# Altium schematic sheet AttinyNodeNRF24.SchDoc
size A4
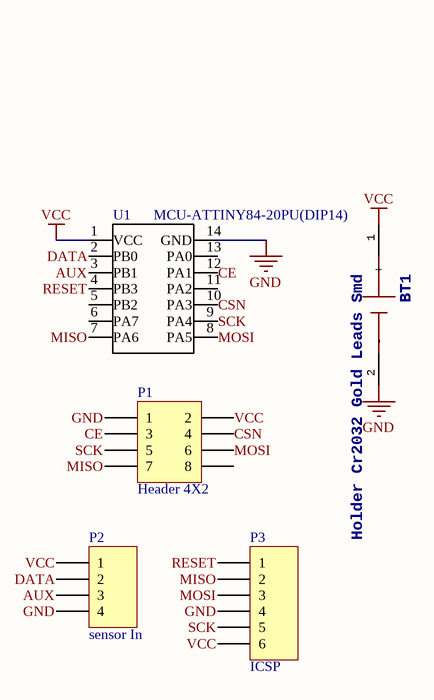
[diagram p0: AttinyNodeNRF24.SchDoc]

## Parts
BT1  Holder Cr2032 Gold Leads Smd  [CR2032 Holder _ "White"]
P1  Header 4X2  [HDR2X4]
P2  sensor In  [HDR1X4]
P3  ICSP  [HDR1X6]
U1  MCU-ATTINY84-20PU(DIP14)  [*DIP14-2.54-17.24X6.35MM]

## Nets
GND: BT1.2(-) P1.1 P2.4 P3.4 U1.14(GND)
VCC: BT1.1(+) P1.2 P2.1 P3.6 U1.1(VCC)
AUX: P2.3 U1.3(PB1)
CE: P1.3 U1.12(PA1)
CSN: P1.4 U1.10(PA3)
DATA: P2.2 U1.2(PB0)
MISO: P1.7 P3.2 U1.7(PA6)
MOSI: P1.6 P3.3 U1.8(PA5)
RESET: P3.1 U1.4(PB3)
SCK: P1.5 P3.5 U1.9(PA4)

Not connected (* = marked no-connect by the designer): P1 8; U1 5(PB2) 6(PA7) 11(PA2) 13(PA0)

## Library data of the parts
BT1 = BU2032SM-BT-GTR: MF: MPD; Price: 0.64 USD; Package: None; Availability: Good; MP: BU2032SM-BT-GTR
P1 = Header 4X2: Header, 4-Pin, Dual row; LatestRevisionDate: 17-Jul-2002; LatestRevisionNote: Re-released for DXP Platform.; Publisher: Altium Limited
P2 = Header 4: Header, 4-Pin; LatestRevisionDate: 17-Jul-2002; LatestRevisionNote: Re-released for DXP Platform.; Publisher: Altium Limited
P3 = Header 6: Header, 6-Pin; LatestRevisionDate: 17-Jul-2002; LatestRevisionNote: Re-released for DXP Platform.; Publisher: Altium Limited
U1 = MCU-ATTINY84-20PU(DIP14): MCU 8-Bit ATtiny AVR RISC 8KB Flash 3.3V/5V 14-Pin PDIP; MF: Microchip; Price: None; Availability: Unavailable; Package: DIP-14 Microchip; MP: ATTINY84-20PU; SnapEDA_Link: https://www.snapeda.com/parts/ATTINY84-20PU/Microchip/view-part/?ref=snap; Value: *